# Altium project DCAC.PrjPcb (part 6 of 11)
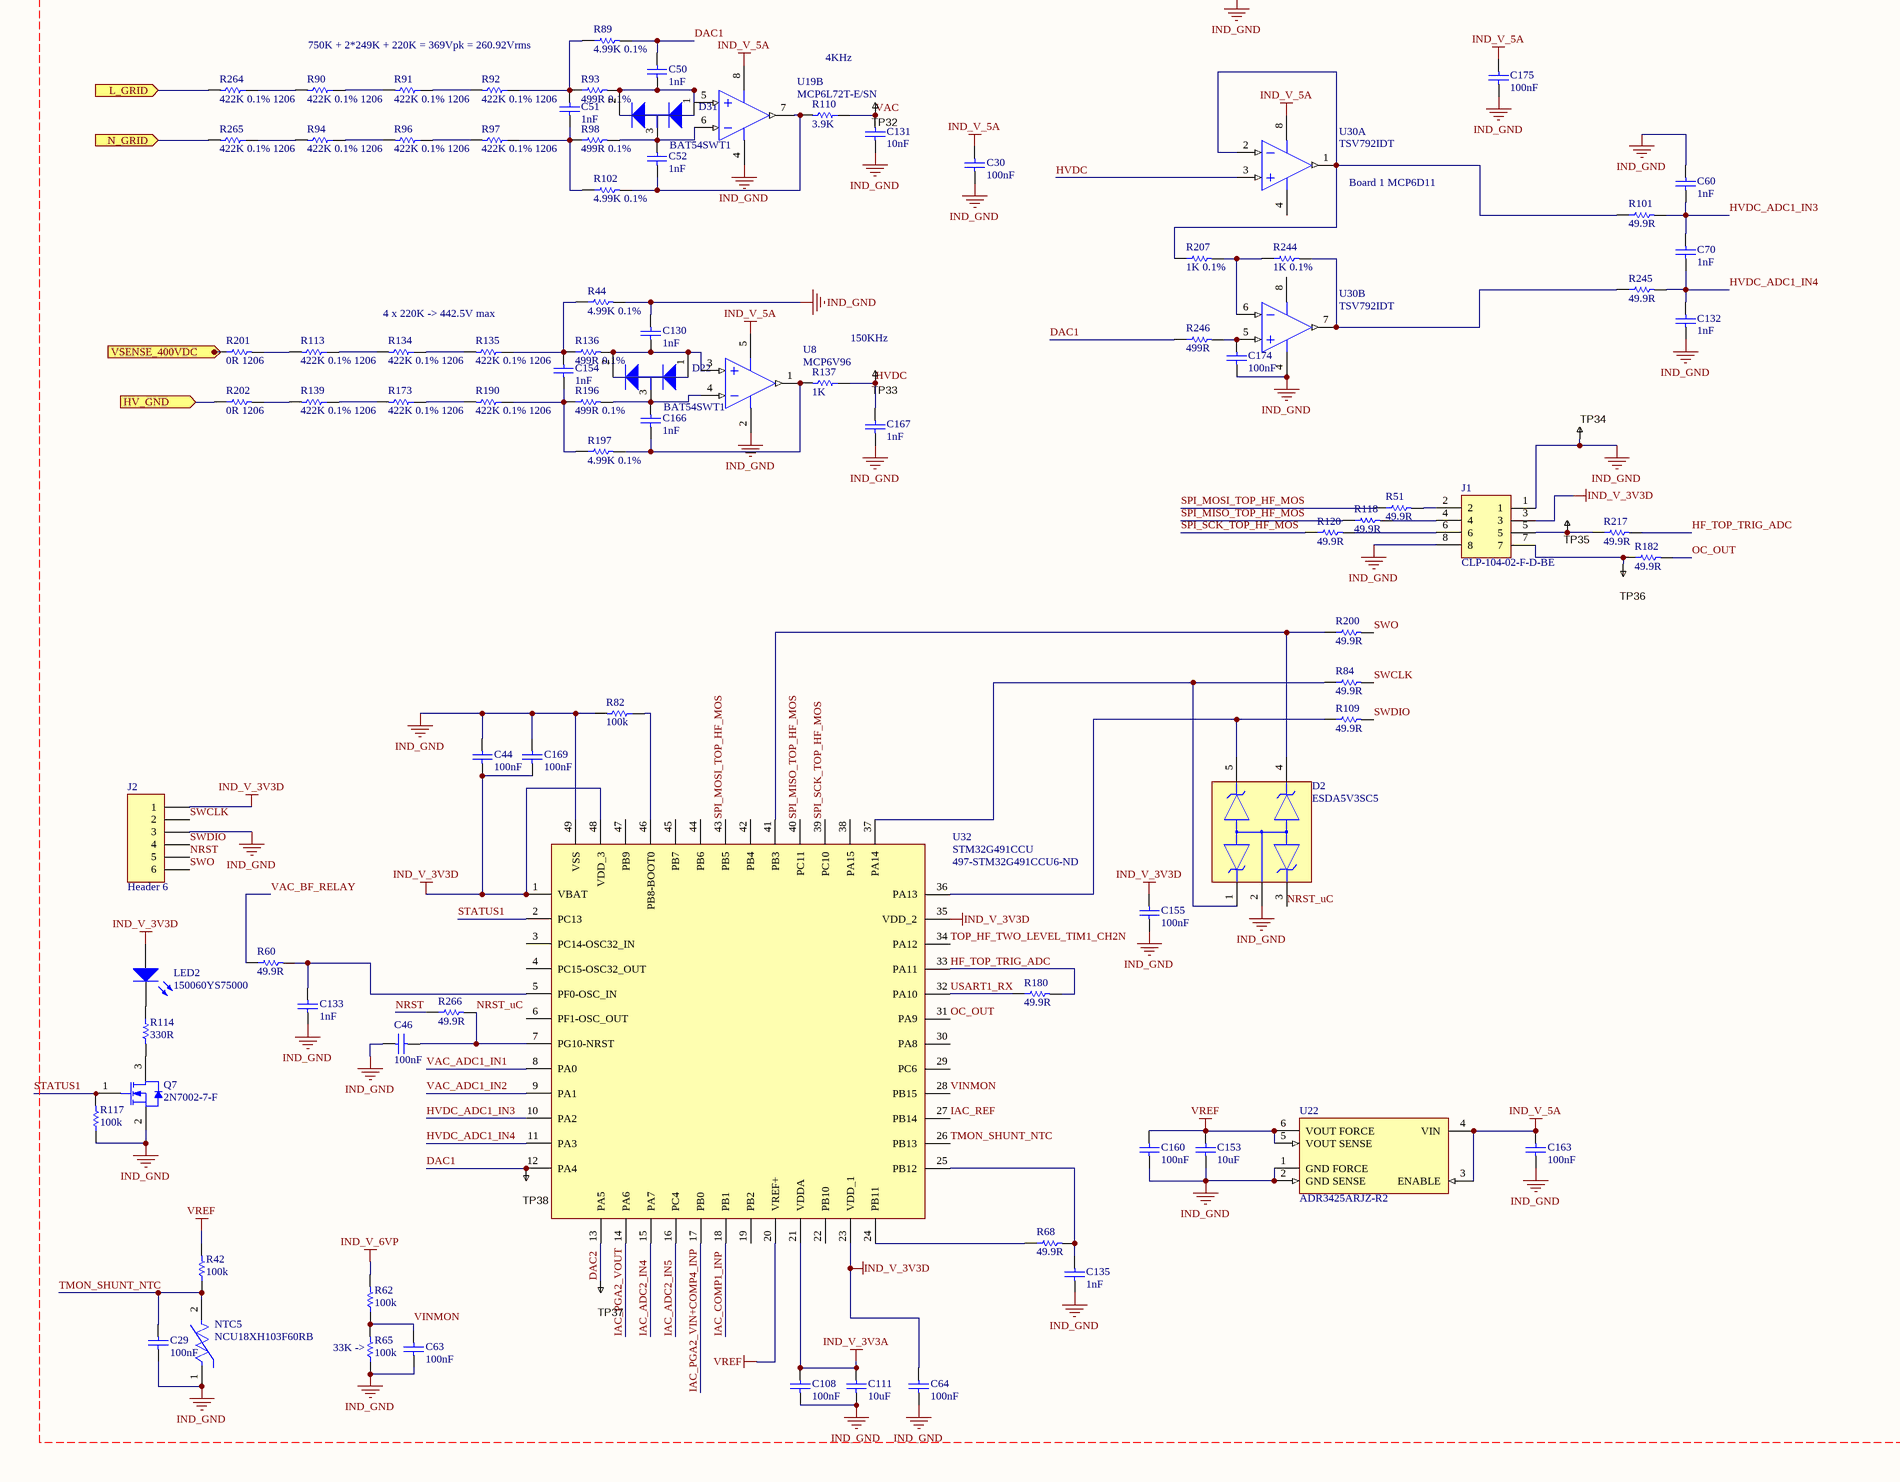
[diagram p16: IND_CURRENT_SENSE.SchDoc, bottom]

## Sheet IND_CURRENT_SENSE.SchDoc (continued)
### Library data of the parts
BR2 = CD-HD2006L: Bridge Rectifier; Manufacturer_Name: Bourns; Datasheet Link: https://componentsearchengine.com/Datasheets/1/CD-HD2006L.pdf; Height: 1.22mm; Manufacturer_Part_Number: CD-HD2006L; Mouser Part Number: 652-CD-HD2006L; Mouser Price/Stock: https://www.mouser.co.uk/ProductDetail/Bourns/CD-HD2006L?qs=zwwtnr6GuIxiiAFbFRVfeg%3D%3D; Arrow Part Number: CD-HD2006L; Arrow Price/Stock: https://www.arrow.com/en/products/cd-hd2006l/bourns
C7 C162 = CAP: X5R ±10% 10V 22uF 1206 Multilayer Ceramic Capacitors MLCC - SMD/SMT ROHS; Manufacturer: Kyocera AVX; Manufacturer Part Number: 12066C226KAT2A; Tolerance: Â±10%; Case-EIA: 1206; Rated Voltage: 6.3 V; Case-Metric: 3216; Voltage Rating: 6.3V; Dielectric: X7R; Dissipation Factor: 5%; Technology: SMT; Max Thickness: 1.9 mm; Value: 22uF; Supplier 1: Digi-Key; Supplier Part Number 1: 478-5997-1-ND; RoHS: Yes; Category: Ceramic Capacitors; Stock 1: 4915; Pricing 1: 1=0.81000, 10=0.57100, 100=0.37570, 500=0.27830, 1000=0.23656 (USD); Mount: Surface Mount; Case/Package: 1206; Number of Pins: 2; Case Code (Imperial): 1206; Case Code (Metric): 3216; Contact Plating: Tin,Matte; Min Operating Temperature: -55°C; Max Operating Temperature: 125°C; Capacitance: 22uF; Packaging: Tape and Reel; Package Quantity: 2500; Termination: SMD/SMT; Voltage Rating (DC): 6.3V; Voltage: 6.3V; Length: 3.2mm; Height: 1.78mm; Width: 1.6mm; Depth: 1.6mm; Thickness: 0.07inch; Radiation Hardening: No; REACH SVHC: No SVHC; Lead Free: Lead Free; ComponentLink1URL: https://datasheet.ciiva.com/11786/0900766b80dc2409-11786266.pdf?src-supplier=RSComponents; ComponentLink1Description: https://datasheet.ciiva.com/11786/0900766b80dc2409-11786266.pdf?src-supplier=RSComponents; ComponentLink2URL: https://datasheet.ciiva.com/16315/cx7r-16315655.pdf?src-supplier=Future+Electronics; ComponentLink2Description: https://datasheet.ciiva.com/16315/cx7r-16315655.pdf?src-supplier=Future+Electronics; ComponentLink3URL: https://datasheet.ciiva.com/154/cx7r-154924.pdf?src-supplier=Digi-Key; ComponentLink3Description: https://datasheet.ciiva.com/154/cx7r-154924.pdf?src-supplier=Digi-Key; ComponentLink4URL: https://datasheet.ciiva.com/154/cx7r-154925.pdf?src-supplier=Digi-Key; ComponentLink4Description: https://datasheet.ciiva.com/154/cx7r-154925.pdf?src-supplier=Digi-Key; ComponentLink5URL: https://datasheet.ciiva.com/154/cx7r-154926.pdf?src-supplier=Digi-Key; ComponentLink5Description: https://datasheet.ciiva.com/154/cx7r-154926.pdf?src-supplier=Digi-Key; Parameter 1: *; JLCPCB Part #: C5672
C11 C12 C156 = CAP-NP-2: X5R ±10% 50V 1uF 0603 Multilayer Ceramic Capacitors MLCC - SMD/SMT ROHS; Manufacturer: AVX; Rated Voltage: 10V; Capacitance: 1µF; Datasheet Version: 10/2007; Mounting Technology: SurfaceMount; Datasheet URL: https://datasheet.ciiva.com/11787/0900766b80a45521-11787469.pdf; Tolerance (%): ±10%; Package Description: 2-Pin Surface Mount Device, Body 1.6 x 0.81 mm; Case Size/Dimension: 0603; Package Reference: 0603; Manufacturer URL: http://www.avx.com/; Dielectric: X5R; Parameter 1: *; JLCPCB Part #: C15849
C18 = CAP-NP-2: X7R ±10% 50V 4.7uF 1206 Multilayer Ceramic Capacitors MLCC - SMD/SMT ROHS; Manufacturer: Kemet; Temperature Coefficient / Code: +/-15%; Voltage Rating DC: 25V; Capacitance - nF: 1000nF; Class: Class1; Case Length: 3.2mm; Type: SMDMLCCX7R6.3-250VDCCommericalGrade; Case Width: 1.6mm; Product: GeneralTypeMLCCs; Dielectric: X7R; Datasheet URL: https://ciiva.com/datasheet-click-18194173?src=ciiva&sig=6daff8c4; Operating Temperature Range: -55Cto+125C; Series: C1206C; RoHS: Details; Product Category: MultilayerCeramicCapacitorsMLCC-SMD/SMT; Manufacturer URL: http://www.kemet.com/; Minimum Operating Temperature: -55C; Dimensions: 1.6mmWx3.2mmLx1.6mmH; Termination Style: SMD/SMT; Brand: Kemet; Packaging: Reel; Package / Case: 1206(3216metric); Case Code - mm: 3216; Datasheet Version: Jul-14; Factory Pack Quantity: 2000; Package Description: 2-Pin Surface Mount Device, Body 3.2 x 1.6 mm; Tolerance: 10%; Package Reference: 1206; Case Height: 1.6mm; Case Code - in: 1206; Maximum Operating Temperature: +125C; Voltage Rating: 25V; Parameter 1: *; JLCPCB Part #: C29823
C19 C21 C30 C31 C44 C65 C73 C79 C96 C128 C139 C148 C152 C155 C158 C163 C169 C174 C175 = CAP: X7R 100nF ±10% 50V 0603 Multilayer Ceramic Capacitors MLCC - SMD/SMT ROHS; Part Number: GCM188R72A104KA64D; Manufacturer: Murata; Manufacturer Part Number: CC0603KRX7R9BB104; Voltage Rating: 100V; Supplier 1: Arrow Electronics; Supplier Part Number 1: GCM188R72A104KA64D; RoHS: Yes; Category: Ceramic Capacitors; Mount: Surface Mount; Case/Package: 0603; Case Code (Imperial): 0603; Case Code (Metric): 1608; Min Operating Temperature: -55°C; Max Operating Temperature: 125°C; Tolerance: 10%; Packaging: Tape and Reel; Capacitance: 100nF; Dielectric: X7R; Termination: SMD/SMT; Voltage Rating (DC): 100V; Length: 1.6mm; Height: 0.8mm; Depth: 0.8mm; Radiation Hardening: No; ComponentLink1URL: https://datasheet.ciiva.com/17451/product-17451047.pdf?src-supplier=Avnet+Europe; ComponentLink1Description: https://datasheet.ciiva.com/17451/product-17451047.pdf?src-supplier=Avnet+Europe; ComponentLink2URL: https://datasheet.ciiva.com/26889/getdatasheetpartid-387765-26889164.pdf?src-supplier=Verical; ComponentLink2Description: https://datasheet.ciiva.com/26889/getdatasheetpartid-387765-26889164.pdf?src-supplier=Verical; Parameter 1: *; JLCPCB Part #: C14663
C20 = CAP: X7R 1nF ±10% 50V 0402 Multilayer Ceramic Capacitors MLCC - SMD/SMT ROHS; Manufacturer: AVX Interconnect / Elco; Part Number: 04025C102MAT2A; Tolerance: 20%; Supplier 1: Digi-Key; Supplier Part Number 1: 478-5130-1-ND; Manufacturer Part Number: 04025C102MAT2A; RoHS: Yes; Category: Ceramic Capacitors; Stock 1: 32316; Pricing 1: 1=0.10000, 10=0.03300, 50=0.01800, 100=0.01470, 500=0.01046, 1000=0.00822, 2500=0.00748, 5000=0.00688 (USD); Mount: Surface Mount; Case/Package: 0402; Case Code (Metric): 1005; Case Code (Imperial): 0402; Min Operating Temperature: -55°C; Max Operating Temperature: 125°C; Capacitance: 1nF; Voltage Rating: 50V; Packaging: Tape and Reel; Package Quantity: 1; Voltage Rating (DC): 50V; Dielectric: X7R; Voltage: 50V; Series: -; Termination: SMD/SMT; Construction: Flat; Length: 1mm; Width: 0.02inch; Height: 0.56mm; Thickness: 0.022inch; Depth: 0.5mm; Radiation Hardening: No; RoHS Compliant: Yes; Lead Free: Lead Free; REACH SVHC: No SVHC; ComponentLink1URL: https://datasheet.ciiva.com/11787/0900766b80dc2409-11787048.pdf?src-supplier=RSComponents; ComponentLink1Description: https://datasheet.ciiva.com/11787/0900766b80dc2409-11787048.pdf?src-supplier=RSComponents; ComponentLink2URL: https://datasheet.ciiva.com/150/cx7r-150278.pdf?src-supplier=Digi-Key; ComponentLink2Description: https://datasheet.ciiva.com/150/cx7r-150278.pdf?src-supplier=Digi-Key; ComponentLink3URL: https://datasheet.ciiva.com/5424/cx7r-218113-5424822.pdf?src-supplier=Mouser; ComponentLink3Description: https://datasheet.ciiva.com/5424/cx7r-218113-5424822.pdf?src-supplier=Mouser; ComponentLink4URL: https://datasheet.ciiva.com/150/cx7r-150279.pdf?src-supplier=Digi-Key; ComponentLink4Description: https://datasheet.ciiva.com/150/cx7r-150279.pdf?src-supplier=Digi-Key; ComponentLink5URL: https://datasheet.ciiva.com/150/cx7r-150280.pdf?src-supplier=Digi-Key; ComponentLink5Description: https://datasheet.ciiva.com/150/cx7r-150280.pdf?src-supplier=Digi-Key; ComponentLink6URL: https://datasheet.ciiva.com/16327/cx7r-16327672.pdf?src-supplier=Future+Electronics; ComponentLink6Description: https://datasheet.ciiva.com/16327/cx7r-16327672.pdf?src-supplier=Future+Electronics; ComponentLink7URL: https://datasheet.ciiva.com/1123/1679506-1123707.pdf?src-supplier=Element14; ComponentLink7Description: https://datasheet.ciiva.com/1123/1679506-1123707.pdf?src-supplier=Element14; ComponentLink8URL: https://datasheet.ciiva.com/1123/1679506-1123708.pdf?src-supplier=Element14; ComponentLink8Description: https://datasheet.ciiva.com/1123/1679506-1123708.pdf?src-supplier=Element14; ComponentLink9URL: https://datasheet.ciiva.com/11510/cx7r-11510958.pdf?src-supplier=Avnet; ComponentLink9Description: https://datasheet.ciiva.com/11510/cx7r-11510958.pdf?src-supplier=Avnet; ComponentLink10URL: https://datasheet.ciiva.com/16623/cx7r-16623374.pdf?src-supplier=Avnet+Europe; ComponentLink10Description: https://datasheet.ciiva.com/16623/cx7r-16623374.pdf?src-supplier=Avnet+Europe; JLCPCB Part #: C1523
C22 C99 C131 C151 C190 = CMP-2006-02924-1: X7R ±10% 50V 10nF 0603 Multilayer Ceramic Capacitors MLCC - SMD/SMT ROHS; Part Number: GRM188R71H472KA01D; Manufacturer: Murata; Capacitance: 4.7nF; Insulation Resistance: 10GR; Supplier 1: Farnell; Supplier Part Number 1: 1118177; Manufacturer Part Number: GRM188R71H472KA01D; RoHS: Yes; Category: Ceramic Capacitors; Pricing 1: 1=19.92000, 3=19.13000 (GBP); Mount: Surface Mount; Case/Package: 0603; Number of Pins: 2; Case Code (Imperial): 0603; Case Code (Metric): 1608; Dielectric Material: Ceramic; Material: Ceramic; Min Operating Temperature: -55°C; Max Operating Temperature: 125°C; Voltage Rating (DC): 50V; Tolerance: 10%; Packaging: Tape and Reel; Dielectric: X7R; Series: GRM; Voltage Rating: 50V; Package Quantity: 1; Termination: SMD/SMT; Voltage: 50V; Length: 1.6mm; Width: 0.8mm; Height: 0.8mm; Depth: 0.8mm; Thickness: 0.035inch; Radiation Hardening: No; RoHS Compliant: Yes; REACH SVHC: No SVHC; Lead Free: Lead Free; ComponentLink1URL: https://datasheet.ciiva.com/5412/product-5412608.pdf?src-supplier=Mouser; ComponentLink1Description: https://datasheet.ciiva.com/5412/product-5412608.pdf?src-supplier=Mouser; ComponentLink2URL: https://datasheet.ciiva.com/18102/getdatasheetpartid-75298-18102657.pdf?src-supplier=Verical; ComponentLink2Description: https://datasheet.ciiva.com/18102/getdatasheetpartid-75298-18102657.pdf?src-supplier=Verical; ComponentLink3URL: https://datasheet.ciiva.com/11787/0900766b8003061f-11787116.pdf?src-supplier=RSComponents; ComponentLink3Description: https://datasheet.ciiva.com/11787/0900766b8003061f-11787116.pdf?src-supplier=RSComponents; ComponentLink4URL: https://datasheet.ciiva.com/29201/451888-da-01-en-vs-kondensator-0603-29201828.pdf?src-supplier=Conrad; ComponentLink4Description: https://datasheet.ciiva.com/29201/451888-da-01-en-vs-kondensator-0603-29201828.pdf?src-supplier=Conrad; ComponentLink5URL: https://datasheet.ciiva.com/7937/4360-7937669.pdf?src-supplier=Element14; ComponentLink5Description: https://datasheet.ciiva.com/7937/4360-7937669.pdf?src-supplier=Element14; ComponentLink6URL: https://datasheet.ciiva.com/48428/nmgrm-data-en-48428597.pdf?src-supplier=Distrelec; ComponentLink6Description: https://datasheet.ciiva.com/48428/nmgrm-data-en-48428597.pdf?src-supplier=Distrelec; ComponentLink7URL: https://datasheet.ciiva.com/7937/4360-7937670.pdf?src-supplier=Element14; ComponentLink7Description: https://datasheet.ciiva.com/7937/4360-7937670.pdf?src-supplier=Element14; ComponentLink8URL: https://datasheet.ciiva.com/7937/4360-7937671.pdf?src-supplier=Element14; ComponentLink8Description: https://datasheet.ciiva.com/7937/4360-7937671.pdf?src-supplier=Element14; ComponentLink9URL: https://datasheet.ciiva.com/130/partnumbering-e-01-130733.pdf?src-supplier=Digi-Key; ComponentLink9Description: https://datasheet.ciiva.com/130/partnumbering-e-01-130733.pdf?src-supplier=Digi-Key; ComponentLink10URL: https://datasheet.ciiva.com/130/partnumbering-e-01-130734.pdf?src-supplier=Digi-Key; ComponentLink10Description: https://datasheet.ciiva.com/130/partnumbering-e-01-130734.pdf?src-supplier=Digi-Key; ComponentLink11URL: https://datasheet.ciiva.com/130/partnumbering-e-01-130735.pdf?src-supplier=Digi-Key; ComponentLink11Description: https://datasheet.ciiva.com/130/partnumbering-e-01-130735.pdf?src-supplier=Digi-Key; JLCPCB Part #: C57112
C29 C46 C63 C64 C108 C160 = CAP: X7R 100nF ±10% 16V 0402 Multilayer Ceramic Capacitors MLCC - SMD/SMT ROHS; Manufacturer: AVX Interconnect / Elco; Part Number: 04026D104KAT2A; Voltage Rating: 6.3V; Dielectric: X5R; Supplier 1: Newark; Supplier Part Number 1: 34M9214; Manufacturer Part Number: 04026D104KAT2A; RoHS: Yes; Category: Ceramic Capacitors; Stock 1: 1436; Pricing 1: 10=0.02800, 25=0.02300, 50=0.01800, 100=0.01200, 250=0.01100, 500=0.00900, 1000=0.00700 (USD); Mount: Surface Mount; Case/Package: 0402; Case Code (Metric): 1005; Case Code (Imperial): 0402; Contact Plating: Tin,Matte; Dielectric Material: Ceramic; Min Operating Temperature: -55°C; Max Operating Temperature: 85°C; Package Quantity: 1; Packaging: Tape and Reel; Capacitance: 100nF; Tolerance: 10%; Voltage Rating (DC): 6.3V; Voltage: 6.3V; Termination: SMD/SMT; Series: -; Construction: Flat; Length: 1mm; Width: 0.02inch; Height: 0.56mm; Thickness: 0.022inch; Depth: 0.5mm; Radiation Hardening: No; REACH SVHC: No SVHC; Lead Free: Lead Free; RoHS Compliant: Yes; Parameter 1: *; JLCPCB Part #: C1525
C32 C39 C50-C52 C130 C145-C147 C154 C166 = CMP-2006-04245-1: X7R 1nF ±10% 50V 0603 Multilayer Ceramic Capacitors MLCC - SMD/SMT ROHS; Manufacturer: AVX Interconnect / Elco; Part Number: 06035A151JAT2A.; Manufacturer Part Number: 06035A151JAT2A; Capacitance: 100pF; Tolerance: 5%; Dielectric: C0G; Temperature Coefficient: 30ppm/°C; Insulation Resistance: 100GR; Supplier 1: Digi-Key; Supplier Part Number 1: 478-1177-1-ND; RoHS: Yes; Category: Ceramic Capacitors; Stock 1: 63714; Pricing 1: 1=0.12000, 10=0.08900, 100=0.04180, 500=0.02932, 1000=0.02428 (USD); Mount: Surface Mount,PCB; Case/Package: 0603; Number of Pins: 2; Case Code (Metric): 1608; Case Code (Imperial): 0603; Dielectric Material: Ceramic; Contact Plating: Tin,Matte; Min Operating Temperature: -55°C; Max Operating Temperature: 125°C; Voltage Rating (DC): 50V; Voltage Rating: 50V; Packaging: Tape and Reel; Package Quantity: 1; Termination: SMD/SMT; Voltage: 50V; Length: 1.6mm; Height: 0.86mm; Width: 0.032inch; Depth: 0.81mm; Thickness: 0.035inch; Radiation Hardening: No; Lead Free: Lead Free; REACH SVHC: No SVHC; ComponentLink1URL: https://datasheet.ciiva.com/1124/84496-1124721.pdf?src-supplier=Element14; ComponentLink1Description: https://datasheet.ciiva.com/1124/84496-1124721.pdf?src-supplier=Element14; ComponentLink2URL: https://datasheet.ciiva.com/2987/ccog-2987781.pdf?src-supplier=Avnet; ComponentLink2Description: https://datasheet.ciiva.com/2987/ccog-2987781.pdf?src-supplier=Avnet; ComponentLink3URL: https://datasheet.ciiva.com/7855/759117-7855061.pdf?src-supplier=Element14; ComponentLink3Description: https://datasheet.ciiva.com/7855/759117-7855061.pdf?src-supplier=Element14; ComponentLink4URL: https://datasheet.ciiva.com/2987/ccog-2987782.pdf?src-supplier=Avnet; ComponentLink4Description: https://datasheet.ciiva.com/2987/ccog-2987782.pdf?src-supplier=Avnet; ComponentLink5URL: https://datasheet.ciiva.com/156/ccog-156216.pdf?src-supplier=Digi-Key; ComponentLink5Description: https://datasheet.ciiva.com/156/ccog-156216.pdf?src-supplier=Digi-Key; ComponentLink6URL: https://datasheet.ciiva.com/156/ccog-156217.pdf?src-supplier=Digi-Key; ComponentLink6Description: https://datasheet.ciiva.com/156/ccog-156217.pdf?src-supplier=Digi-Key; ComponentLink7URL: https://datasheet.ciiva.com/156/ccog-156218.pdf?src-supplier=Digi-Key; ComponentLink7Description: https://datasheet.ciiva.com/156/ccog-156218.pdf?src-supplier=Digi-Key; ComponentLink8URL: https://datasheet.ciiva.com/16300/ccog-16300429.pdf?src-supplier=Future+Electronics; ComponentLink8Description: https://datasheet.ciiva.com/16300/ccog-16300429.pdf?src-supplier=Future+Electronics; ComponentLink9URL: https://datasheet.ciiva.com/22699/84496-22699966.pdf?src-supplier=Element14; ComponentLink9Description: https://datasheet.ciiva.com/22699/84496-22699966.pdf?src-supplier=Element14; ComponentLink10URL: https://datasheet.ciiva.com/5418/ccog-5418335.pdf?src-supplier=Mouser; ComponentLink10Description: https://datasheet.ciiva.com/5418/ccog-5418335.pdf?src-supplier=Mouser; ComponentLink11URL: https://datasheet.ciiva.com/16538/ccog-16538111.pdf?src-supplier=Avnet+Asia; ComponentLink11Description: https://datasheet.ciiva.com/16538/ccog-16538111.pdf?src-supplier=Avnet+Asia; Parameter 2: *; JLCPCB Part #: C1588
C34 C40 C41 C60 C70 C83 C84 C132 C133 C135 C164 C165 = CMP-2008-02701-1: X7R 1nF ±10% 50V 0402 Multilayer Ceramic Capacitors MLCC - SMD/SMT ROHS; Manufacturer: AVX Interconnect / Elco; Part Number: 04025C102MAT2A; Tolerance: 20%; Supplier 1: Digi-Key; Supplier Part Number 1: 478-5130-1-ND; Manufacturer Part Number: 04025C102MAT2A; RoHS: Yes; Category: Ceramic Capacitors; Stock 1: 32316; Pricing 1: 1=0.10000, 10=0.03300, 50=0.01800, 100=0.01470, 500=0.01046, 1000=0.00822, 2500=0.00748, 5000=0.00688 (USD); Mount: Surface Mount; Case/Package: 0402; Case Code (Metric): 1005; Case Code (Imperial): 0402; Min Operating Temperature: -55°C; Max Operating Temperature: 125°C; Capacitance: 1nF; Voltage Rating: 50V; Packaging: Tape and Reel; Package Quantity: 1; Voltage Rating (DC): 50V; Dielectric: X7R; Voltage: 50V; Series: -; Termination: SMD/SMT; Construction: Flat; Length: 1mm; Width: 0.02inch; Height: 0.56mm; Thickness: 0.022inch; Depth: 0.5mm; Radiation Hardening: No; RoHS Compliant: Yes; Lead Free: Lead Free; REACH SVHC: No SVHC; ComponentLink1URL: https://datasheet.ciiva.com/11787/0900766b80dc2409-11787048.pdf?src-supplier=RSComponents; ComponentLink1Description: https://datasheet.ciiva.com/11787/0900766b80dc2409-11787048.pdf?src-supplier=RSComponents; ComponentLink2URL: https://datasheet.ciiva.com/150/cx7r-150278.pdf?src-supplier=Digi-Key; ComponentLink2Description: https://datasheet.ciiva.com/150/cx7r-150278.pdf?src-supplier=Digi-Key; ComponentLink3URL: https://datasheet.ciiva.com/5424/cx7r-218113-5424822.pdf?src-supplier=Mouser; ComponentLink3Description: https://datasheet.ciiva.com/5424/cx7r-218113-5424822.pdf?src-supplier=Mouser; ComponentLink4URL: https://datasheet.ciiva.com/150/cx7r-150279.pdf?src-supplier=Digi-Key; ComponentLink4Description: https://datasheet.ciiva.com/150/cx7r-150279.pdf?src-supplier=Digi-Key; ComponentLink5URL: https://datasheet.ciiva.com/150/cx7r-150280.pdf?src-supplier=Digi-Key; ComponentLink5Description: https://datasheet.ciiva.com/150/cx7r-150280.pdf?src-supplier=Digi-Key; ComponentLink6URL: https://datasheet.ciiva.com/16327/cx7r-16327672.pdf?src-supplier=Future+Electronics; ComponentLink6Description: https://datasheet.ciiva.com/16327/cx7r-16327672.pdf?src-supplier=Future+Electronics; ComponentLink7URL: https://datasheet.ciiva.com/1123/1679506-1123707.pdf?src-supplier=Element14; ComponentLink7Description: https://datasheet.ciiva.com/1123/1679506-1123707.pdf?src-supplier=Element14; ComponentLink8URL: https://datasheet.ciiva.com/1123/1679506-1123708.pdf?src-supplier=Element14; ComponentLink8Description: https://datasheet.ciiva.com/1123/1679506-1123708.pdf?src-supplier=Element14; ComponentLink9URL: https://datasheet.ciiva.com/11510/cx7r-11510958.pdf?src-supplier=Avnet; ComponentLink9Description: https://datasheet.ciiva.com/11510/cx7r-11510958.pdf?src-supplier=Avnet; ComponentLink10URL: https://datasheet.ciiva.com/16623/cx7r-16623374.pdf?src-supplier=Avnet+Europe; ComponentLink10Description: https://datasheet.ciiva.com/16623/cx7r-16623374.pdf?src-supplier=Avnet+Europe; JLCPCB Part #: C1523
C36 C167 = CAP: X7R 1nF ±10% 50V 0603 Multilayer Ceramic Capacitors MLCC - SMD/SMT ROHS; Manufacturer: AVX Interconnect / Elco; Part Number: 06035A151JAT2A.; Manufacturer Part Number: 06035A151JAT2A; Capacitance: 100pF; Tolerance: 5%; Dielectric: C0G; Temperature Coefficient: 30ppm/°C; Insulation Resistance: 100GR; Supplier 1: Digi-Key; Supplier Part Number 1: 478-1177-1-ND; RoHS: Yes; Category: Ceramic Capacitors; Stock 1: 63714; Pricing 1: 1=0.12000, 10=0.08900, 100=0.04180, 500=0.02932, 1000=0.02428 (USD); Mount: Surface Mount,PCB; Case/Package: 0603; Number of Pins: 2; Case Code (Metric): 1608; Case Code (Imperial): 0603; Dielectric Material: Ceramic; Contact Plating: Tin,Matte; Min Operating Temperature: -55°C; Max Operating Temperature: 125°C; Voltage Rating (DC): 50V; Voltage Rating: 50V; Packaging: Tape and Reel; Package Quantity: 1; Termination: SMD/SMT; Voltage: 50V; Length: 1.6mm; Height: 0.86mm; Width: 0.032inch; Depth: 0.81mm; Thickness: 0.035inch; Radiation Hardening: No; Lead Free: Lead Free; REACH SVHC: No SVHC; ComponentLink1URL: https://datasheet.ciiva.com/1124/84496-1124721.pdf?src-supplier=Element14; ComponentLink1Description: https://datasheet.ciiva.com/1124/84496-1124721.pdf?src-supplier=Element14; ComponentLink2URL: https://datasheet.ciiva.com/2987/ccog-2987781.pdf?src-supplier=Avnet; ComponentLink2Description: https://datasheet.ciiva.com/2987/ccog-2987781.pdf?src-supplier=Avnet; ComponentLink3URL: https://datasheet.ciiva.com/7855/759117-7855061.pdf?src-supplier=Element14; ComponentLink3Description: https://datasheet.ciiva.com/7855/759117-7855061.pdf?src-supplier=Element14; ComponentLink4URL: https://datasheet.ciiva.com/2987/ccog-2987782.pdf?src-supplier=Avnet; ComponentLink4Description: https://datasheet.ciiva.com/2987/ccog-2987782.pdf?src-supplier=Avnet; ComponentLink5URL: https://datasheet.ciiva.com/156/ccog-156216.pdf?src-supplier=Digi-Key; ComponentLink5Description: https://datasheet.ciiva.com/156/ccog-156216.pdf?src-supplier=Digi-Key; ComponentLink6URL: https://datasheet.ciiva.com/156/ccog-156217.pdf?src-supplier=Digi-Key; ComponentLink6Description: https://datasheet.ciiva.com/156/ccog-156217.pdf?src-supplier=Digi-Key; ComponentLink7URL: https://datasheet.ciiva.com/156/ccog-156218.pdf?src-supplier=Digi-Key; ComponentLink7Description: https://datasheet.ciiva.com/156/ccog-156218.pdf?src-supplier=Digi-Key; ComponentLink8URL: https://datasheet.ciiva.com/16300/ccog-16300429.pdf?src-supplier=Future+Electronics; ComponentLink8Description: https://datasheet.ciiva.com/16300/ccog-16300429.pdf?src-supplier=Future+Electronics; ComponentLink9URL: https://datasheet.ciiva.com/22699/84496-22699966.pdf?src-supplier=Element14; ComponentLink9Description: https://datasheet.ciiva.com/22699/84496-22699966.pdf?src-supplier=Element14; ComponentLink10URL: https://datasheet.ciiva.com/5418/ccog-5418335.pdf?src-supplier=Mouser; ComponentLink10Description: https://datasheet.ciiva.com/5418/ccog-5418335.pdf?src-supplier=Mouser; ComponentLink11URL: https://datasheet.ciiva.com/16538/ccog-16538111.pdf?src-supplier=Avnet+Asia; ComponentLink11Description: https://datasheet.ciiva.com/16538/ccog-16538111.pdf?src-supplier=Avnet+Asia; Parameter 2: *; JLCPCB Part #: C1588
C94 C111 C153 C157 = CAP-NP-2: X5R ±10% 10V 10uF 0603 Multilayer Ceramic Capacitors MLCC - SMD/SMT ROHS; Manufacturer: Samsung Electro-Mechanics; Manufacturer Part Number: CL10B104KB8NNNC; Capacitance: 0.1µF; Rated Voltage: 50V; Dielectric: X7R; Case Size/Dimension: 0603; Datasheet URL: https://datasheet.ciiva.com/29198/456651-da-01-en-vs-kondensator-0605-29198839.pdf; Manufacturer URL: http://www.samsungsem.com/global/index.jsp; Tolerance (%): ±10%; Datasheet Version: Nov-10; Supplier 1: Digi-Key; Supplier Part Number 1: 1276-1000-1-ND; RoHS: Yes; Category: Ceramic Capacitors; Stock 1: 13409690; Pricing 1: 1=0.10000, 10=0.03000, 50=0.01620, 100=0.01330, 500=0.00950, 1000=0.00746 (USD); Mount: Surface Mount; Case/Package: 0603; Case Code (Metric): 1608; Case Code (Imperial): 0603; Contact Plating: Tin; Material: Ceramic; Min Operating Temperature: -55°C; Max Operating Temperature: 125°C; Voltage Rating: 50V; Package Quantity: 1; Packaging: Tape and Reel; Tolerance: 10%; Voltage Rating (DC): 50V; Voltage: 50V; Series: CL; Construction: Flat; Length: 1.6mm; Width: 0.031inch; Height: 0.8mm; Depth: 0.8mm; Thickness: 0.035inch; Radiation Hardening: No; Lead Free: Lead Free; RoHS Compliant: Yes; ComponentLink1URL: https://datasheet.ciiva.com/25803/cl10b104kb8nnnc-25803393.pdf?src-supplier=Digi-Key; ComponentLink1Description: https://datasheet.ciiva.com/25803/cl10b104kb8nnnc-25803393.pdf?src-supplier=Digi-Key; ComponentLink2URL: https://datasheet.ciiva.com/26838/getdatasheetpartid-89097-26838411.pdf?src-supplier=Verical; ComponentLink2Description: https://datasheet.ciiva.com/26838/getdatasheetpartid-89097-26838411.pdf?src-supplier=Verical; ComponentLink3URL: https://datasheet.ciiva.com/29198/456651-da-01-en-vs-kondensator-0605-29198839.pdf?src-supplier=Conrad; ComponentLink3Description: https://datasheet.ciiva.com/29198/456651-da-01-en-vs-kondensator-0605-29198839.pdf?src-supplier=Conrad; Parameter 1: *; JLCPCB Part #: C19702
C101 C143 = CAP: X5R 25V ±10% 10uF 0805 Multilayer Ceramic Capacitors MLCC - SMD/SMT ROHS; Part Number: GRM21BR71A106KE51L; Manufacturer: Murata; Parameter 1: *; JLCPCB Part #: C15850
D2 = ba4253d81ba893034e2a76e8f43080a: TVS DIODE 3V SOT323-5; Manufacturer Part Number: ESDA6V1W5; Manufacturer: STMicroelectronics; Value: 90pF; Max Junction Temp: +125°C; Breakdown Voltage: 6.1V; Standoff Height: 0mm; Number Of Channels: 2; Peak Pulse Power: 150W; Direction: Unidirectional; Temperature Range Low: -40°C; Temperature Range High: +125°C; Octopart: https://octopart.com/esda6v1w5-stmicroelectronics-39557953; Device Class L1: Circuit Protection; Digikey Description: TVS DIODE 3V SOT323-5; Mouser Description: TVS Diodes / ESD Suppressors 6.1V 150W Unidirect; Capacitance: 90pF; Device Class L2: TVS Diodes; Reverse Standoff Voltage: 3V; Category: Diode; Ipc Land Pattern Name: SOT65P210X95-5; Lead Free: Yes; ComponentLink2Description: Datasheet; Height: 1.1mm; Temperature: -40°C to +125°C; Package: SOT323-5L; Device Class L3: unset; RoHS: TRUE; ComponentLink2URL: https://www.st.com/resource/en/datasheet/esdaxxxwx.pdf; Automotive: No; Parameter 1: *; JLCPCB Part #: *
D9 D22 D31 D32 = CMP-1055-00560-1: Dual Series Schottky Barrier Diodes, 3-Pin SOT-323, Tape and Reel; Manufacturer: On Semiconductor; IFSM Max (A): 0.6; trr Max (ns): 5; ComponentLink3Description: Package Specification; RoHS: FALSE; ComponentLink1URL: http://www.onsemi.com/; PartNumber: BAT54SWT1; ComponentLink1Description: Manufacturer URL; Packing: Tape and Reel; PackageReference: SOT-323-3-419-04; ComponentLink2URL: http://www.onsemi.cn/pub_link/Collateral/BAT54SWT1-D.PDF; ComponentLink2Description: Datasheet; PackageDescription: 3-Pin Small Outline Transistor, Body 2 x 1.25 mm, Pitch 0.65 mm; Configuration: Dual; ComponentLink3URL: http://www.onsemi.com/pub_link/Collateral/419-04.PDF; Mounting Technology: Surface Mount; PackageVersion: Rev. N, 11/2008; DatasheetVersion: Rev. 10
FB1 FB13 FB19 = CMP-0220-00115-1: SMD EMI Suppression Ferrite Bead WE-CBF, Z = 1500 Ohm; DatasheetVersion: Dec-2005; ComponentLink1URL: http://www.we-online.com; PackageVersion: 2009; PackageDescription: Chip Inductor, 2-Leads, Body 1.6 x 0.8 mm; ComponentLink2URL: http://www.we-online.de/katalog/media/pdf/742792691.pdf; ComponentLink1Description: Manufacturer Link; ComponentLink2Description: Datasheet; Impedance: 1500 Ohm; PackageReference: SMD-0603
J1 = CLP-104-02-F-D-BE: Connector; Manufacturer_Name: SAMTEC; Datasheet Link: http://suddendocs.samtec.com/prints/erm8-xxx-xx.x-xxx-dv-xxxx-xx-mkt.pdf; Manufacturer_Part_Number: CLP-104-02-F-D-BE; Mouser Part Number: 200-CLP10402FDBE; Mouser Price/Stock: https://www.mouser.co.uk/ProductDetail/Samtec/CLP-104-02-F-D-BE?qs=0lQeLiL1qybJIh6Z%2F3PMbA%3D%3D; Arrow Part Number: CLP-104-02-F-D-BE; Arrow Price/Stock: https://www.arrow.com/en/products/clp-104-02-f-d-be/samtec
J2 = Header 6: Header, 6-Pin; LatestRevisionDate: 17-Jul-2002; LatestRevisionNote: Re-released for DXP Platform.; Publisher: Altium Limited
L5 = CMP-08253-000028-1: INDUCTORS FOR POWER CIRCUITS, AU
LED2 = CMP-1426-00005-1: SMD mono-color Chip LED, WL-SMCW, Yellow; Manufacturer: Wuerth Elektronik; Dominant Wavelength: 590nm; Viewing Angle: 140°; Lens Style: Clear,Rectangular; Luminous Intensity: 120mcd; Forward Voltage: 2V; Forward Current: 30mA; Test Current: 20mA; ComponentLink1URL: http://www.we-online.com; PartNumber: 150060YS75000; Color: Yellow; ComponentLink2Description: Datasheet; ComponentLink2URL: http://katalog.we-online.com/led/datasheet/150060YS75000.pdf; ComponentLink1Description: Manufacturer URL; PackageReference: 0603_A; Supplier 1: Digi-Key; Supplier Part Number 1: 732-4981-1-ND; Manufacturer Part Number: 150060YS75000; RoHS: Yes; Category: LEDs; Stock 1: 139; Pricing 1: 1=0.14000, 50=0.13300, 100=0.11400, 500=0.09900 (USD); Mount: Surface Mount; Case/Package: 0603; Case Code (Imperial): 0603; Case Code (Metric): 1608; Min Operating Temperature: -40°C; Max Operating Temperature: 85°C; Packaging: Tape and Reel; Package Quantity: 4000; Wavelength: 590nm; Length: 1.6mm; Height: 0.7mm; Width: 0.8mm; REACH SVHC: Unknown; ComponentLink3URL: https://datasheet.ciiva.com/23843/150060ys75000-23843250.pdf?src-supplier=Newark; ComponentLink3Description: https://datasheet.ciiva.com/23843/150060ys75000-23843250.pdf?src-supplier=Newark; ComponentLink4URL: https://datasheet.ciiva.com/29279/759432-da-01-en-chipled-0603-w-kl-gelb-150060ys75000-29279206.pdf?src-supplier=Conrad; ComponentLink4Description: https://datasheet.ciiva.com/29279/759432-da-01-en-chipled-0603-w-kl-gelb-150060ys75000-29279206.pdf?src-supplier=Conrad; ComponentLink5URL: https://datasheet.ciiva.com/29563/150060ys75000-29563045.pdf?src-supplier=Digi-Key; ComponentLink5Description: https://datasheet.ciiva.com/29563/150060ys75000-29563045.pdf?src-supplier=Digi-Key; ComponentLink6URL: https://datasheet.ciiva.com/22656/1911348-22656951.pdf?src-supplier=Element14; ComponentLink6Description: https://datasheet.ciiva.com/22656/1911348-22656951.pdf?src-supplier=Element14; ComponentLink7URL: https://datasheet.ciiva.com/29563/150060ys75000-29563033.pdf?src-supplier=Digi-Key; ComponentLink7Description: https://datasheet.ciiva.com/29563/150060ys75000-29563033.pdf?src-supplier=Digi-Key; ComponentLink8URL: https://datasheet.ciiva.com/48430/150060ys75000-eng-tds-48430044.pdf?src-supplier=Distrelec; ComponentLink8Description: https://datasheet.ciiva.com/48430/150060ys75000-eng-tds-48430044.pdf?src-supplier=Distrelec
NTC5 = CMP-06022-000443-2: THERMISTOR NTC; Max Operating Temperature: 125°C; REACH SVHC: No SVHC; Case/Package: 0603; Min Operating Temperature: -40°C; RoHS Compliant: Yes; Case Code (Imperial): 0603; Case Code (Metric): 1608
PT_SEC2 = CMP-1024-00320-1: 0.025" SQ Post Header, Through-hole, Right Angle, -55 to 125 degC, 2.54 mm Pitch, 2-Pin, Male, RoHS; Manufacturer: Samtec; Pitch: 2.54 mm; Temperature Range: -55 to 125 degC; PackageDescription: .025[0.64] SQ. Post Terminal Strip Assembly; ComponentLink3Description: Package Specification; ComponentLink2Description: Datasheet; PackageReference: TSW-102-08-X-S-RA; ComponentLink1Description: Manufacturer URL; ComponentLink2URL: http://www.samtec.com/documents/webfiles/pdf/TSW_TH.PDF; PackageVersion: DM, 8/1988; RoHS: True; PartNumber: TSW-102-08-G-S-RA; Mounting Technology: Through-hole; Orientation: Right Angle; ComponentLink1URL: http://www.samtec.com; DatasheetVersion: F-214; ComponentLink3URL: http://www.samtec.com/documents/webfiles/cpdf/TSW-XXX-XX-XXX-X-XX-XXX-MKT.pdf
Q7 = NEMOS-GSD-3: N-Channel Enhancement Mode Field Effect Transistor, 60 V, 0.115 A, -55 to 150 degC, 3-Pin SOT23, RoHS, Tape and Reel; Id - Continuous Drain Current: 115mA; Typical Turn-On Delay Time: 7ns; Typical Turn-Off Delay Time: 11ns; Brand: DiodesIncorporated; Transistor Type: 1N-Channel; Vgs - Gate-Source Voltage: 20V; Rise Time: 3ns; Configuration: Single; Fall Time: 5.6ns; Vds - Drain-Source Breakdown Voltage: 70V; Rds On - Drain-Source Resistance: 7.5Ohms; Number of Channels: 1Channel; Forward Transconductance - Min: 0.08S; Pd - Power Dissipation: 300mW; Unit Weight: 0.000282oz; Datasheet URL: http://datasheet.octopart.com/2N7002-7-F-Diodes-Inc.-datasheet-8326113.pdf; Width: 1.3mm; Series: 2N7002; Length: 2.9mm; Product Category: MOSFET; Minimum Operating Temperature: -55C; Manufacturer URL: http://www.diodes.com/; Mounting Style: SMD/SMT; Package Reference: SOT23-3; Package Description: 3-Pin Small Outline Transistor, Body 2.9 x 1.3 mm, Pitch 0.96 mm; Maximum Operating Temperature: +150C; Transistor Polarity: N-Channel; Factory Pack Quantity: 3000; Technology: Si; Channel Mode: Enhancement; Datasheet Version: Rev. 21-2, 02/2009; Type: EnhancementModeFieldEffectTransistor; RoHS: True; Packaging: Reel; Package / Case: SOT-23-3; Height: 1mm; Product: MOSFETSmallSignal; Manufacturer: DiodesIncorporated; Parameter 1: *; JLCPCB Part #: C8545
R1 = CMP-2100-03667-1: ±1% 0Ω 0.1W 0603 Chip Resistor - Surface Mount ROHS; Manufacturer: Yageo; Manufacturer Part Number: RC0603JR-070RL; Temperature Coefficient: 200ppm/degreesC; Tolerance: 5%; Voltage Rating: 50V; Power Rating: 100mW; Resistance: 0mOhm; Width: 0.8mm; Max Operating Temperature: 155degC; Package Reference: 0603; Height: 0.45mm; Depth: 0.8mm; Package Description: 2-Pin Surface Mount Device, Body 1.6 x 0.8 mm; Termination: SMD/SMT; Package Quantity: 5000; Case/Package: 0603; Case Code (Imperial): 0603; Radiation Hardening: No; Number of Pins: 2; Length: 1.6mm; Lead Free: LeadFree; Voltage Rating (DC): 50V; Military Standard: Not; Datasheet URL: http://www.yageo.com/NewPortal/yageodocoutput?fileName=/pdf/R-Chip/PYu-RC_Group_51_RoHS_L_5.pdf; Manufacturer URL: http://www.yageo.com/; Packaging: TapeandReel; Case Code (Metric): 1608; Min Operating Temperature: -55degC; Composition: ThickFilm; RoHSCompliant: true; Contact Plating: Tin; Datasheet Version: Rev. 5, 10/2016; REACH SVHC: NoSVHC; Supplier 1: Digi-Key; Supplier Part Number 1: 311-0.0GRCT-ND; RoHS: Yes; Category: Chip SMD Resistors; Stock 1: 4763183; Pricing 1: 1=0.10000, 10=0.01700, 25=0.01240, 50=0.00940, 100=0.00700, 250=0.00532, 500=0.00424, 1000=0.00313 (USD); Size Code: 0603; Resistor Type: Thick Film; Max Power Dissipation: 100mW; Number of Terminations: 2; Series: RC; Construction: Rectangular; Features: Moisture Resistant; Technology: THICK FILM; Resistance Tolerance: 5%; RoHS Compliant: Yes; ComponentLink1URL: https://datasheet.ciiva.com/11808/pyu-r-int-6-11808700.pdf?src-supplier=RSComponents; ComponentLink1Description: https://datasheet.ciiva.com/11808/pyu-r-int-6-11808700.pdf?src-supplier=RSComponents; ComponentLink2URL: https://datasheet.ciiva.com/22747/443971-22747530.pdf?src-supplier=Element14; ComponentLink2Description: https://datasheet.ciiva.com/22747/443971-22747530.pdf?src-supplier=Element14; ComponentLink3URL: https://datasheet.ciiva.com/12555/rc0603-272842-12555254.pdf?src-supplier=Mouser; ComponentLink3Description: https://datasheet.ciiva.com/12555/rc0603-272842-12555254.pdf?src-supplier=Mouser; ComponentLink4URL: https://datasheet.ciiva.com/7746/1738695-7746421.pdf?src-supplier=Element14; ComponentLink4Description: https://datasheet.ciiva.com/7746/1738695-7746421.pdf?src-supplier=Element14; ComponentLink5URL: https://datasheet.ciiva.com/7746/1738695-7746422.pdf?src-supplier=Element14; ComponentLink5Description: https://datasheet.ciiva.com/7746/1738695-7746422.pdf?src-supplier=Element14; ComponentLink6URL: https://datasheet.ciiva.com/8883/pyu-rc0603-51-rohs-l-4-8883045.pdf?src-supplier=Avnet; ComponentLink6Description: https://datasheet.ciiva.com/8883/pyu-rc0603-51-rohs-l-4-8883045.pdf?src-supplier=Avnet; ComponentLink7URL: https://datasheet.ciiva.com/15189/getdatasheetpartid-329462-15189845.pdf?src-supplier=Verical; ComponentLink7Description: https://datasheet.ciiva.com/15189/getdatasheetpartid-329462-15189845.pdf?src-supplier=Verical; JLCPCB Part #: C21189
R6 = RES: 18kΩ ±1% ±100ppm/℃ 0.1W 0603 Chip Resistor - Surface Mount ROHS; Manufacturer: Panasonic; Part Number: ERA3AEB183V; Manufacturer Part Number: ERA-3AEB183V; Resistance: 18kR; Power Rating: 100mW; Tolerance: 0.1%; Temperature Coefficient: 25ppm/°C; Voltage Rating (DC): 75V; Supplier 1: Newark; Supplier Part Number 1: 08N2107; RoHS: Yes; Category: Chip SMD Resistors; Stock 1: 2207; Pricing 1: 1=0.35700, 25=0.30700, 50=0.21600, 100=0.12400, 250=0.10000, 500=0.07500, 1000=0.05100 (USD); Mount: Surface Mount; Case/Package: 0603; Number of Pins: 2; Case Code (Metric): 1608; Case Code (Imperial): 0603; Contact Plating: Tin; Size Code: 0603; Min Operating Temperature: -55°C; Max Operating Temperature: 155°C; Packaging: Tape and Reel; Resistor Type: Thin Film; Number of Terminations: 2; Max Power Dissipation: 100mW; Series: ERA-3A; Voltage Rating: 75V; Package Quantity: 1; Termination: SMD/SMT; Features: Automotive AEC-Q200; Resistance Tolerance: 0.1%; Construction: Rectangular; Technology: METAL FILM; Length: 1.6mm; Width: 0.8mm; Height: 0.45mm; Depth: 0.8mm; Radiation Hardening: No; RoHS Compliant: Yes; Lead Free: Lead Free; REACH SVHC: No SVHC; Military Standard: Not; ComponentLink1URL: https://datasheet.ciiva.com/11808/0900766b80fe20f7-11808020.pdf?src-supplier=RSComponents; ComponentLink1Description: https://datasheet.ciiva.com/11808/0900766b80fe20f7-11808020.pdf?src-supplier=RSComponents; ComponentLink2URL: https://datasheet.ciiva.com/29183/451333-da-01-en-widerstand-0603-era-29183823.pdf?src-supplier=Conrad; ComponentLink2Description: https://datasheet.ciiva.com/29183/451333-da-01-en-widerstand-0603-era-29183823.pdf?src-supplier=Conrad; ComponentLink3URL: https://datasheet.ciiva.com/16395/aoa0000ce26-16395253.pdf?src-supplier=Future+Electronics; ComponentLink3Description: https://datasheet.ciiva.com/16395/aoa0000ce26-16395253.pdf?src-supplier=Future+Electronics; ComponentLink4URL: https://datasheet.ciiva.com/16764/70068849-16764837.pdf?src-supplier=Allied+Electronics; ComponentLink4Description: https://datasheet.ciiva.com/16764/70068849-16764837.pdf?src-supplier=Allied+Electronics; ComponentLink5URL: https://datasheet.ciiva.com/9117/aoa0000ce26-9117398.pdf?src-supplier=Avnet; ComponentLink5Description: https://datasheet.ciiva.com/9117/aoa0000ce26-9117398.pdf?src-supplier=Avnet; ComponentLink6URL: https://datasheet.ciiva.com/17211/aoa0000ce26-17211238.pdf?src-supplier=Avnet+Europe; ComponentLink6Description: https://datasheet.ciiva.com/17211/aoa0000ce26-17211238.pdf?src-supplier=Avnet+Europe; ComponentLink7URL: https://datasheet.ciiva.com/22739/485442-22739288.pdf?src-supplier=Element14; ComponentLink7Description: https://datasheet.ciiva.com/22739/485442-22739288.pdf?src-supplier=Element14; ComponentLink8URL: https://datasheet.ciiva.com/48425/era-eng-tds-48425433.pdf?src-supplier=Distrelec; ComponentLink8Description: https://datasheet.ciiva.com/48425/era-eng-tds-48425433.pdf?src-supplier=Distrelec; ComponentLink9URL: https://datasheet.ciiva.com/48530/era-eng-tds-48530218.pdf?src-supplier=Distrelec; ComponentLink9Description: https://datasheet.ciiva.com/48530/era-eng-tds-48530218.pdf?src-supplier=Distrelec; ComponentLink10URL: https://datasheet.ciiva.com/5860/485442-5860507.pdf?src-supplier=Farnell; ComponentLink10Description: https://datasheet.ciiva.com/5860/485442-5860507.pdf?src-supplier=Farnell; ComponentLink11URL: https://datasheet.ciiva.com/16771/70068849-16771099.pdf?src-supplier=Allied+Electronics; ComponentLink11Description: https://datasheet.ciiva.com/16771/70068849-16771099.pdf?src-supplier=Allied+Electronics; ComponentLink12URL: https://datasheet.ciiva.com/5860/485442-5860508.pdf?src-supplier=Farnell; ComponentLink12Description: https://datasheet.ciiva.com/5860/485442-5860508.pdf?src-supplier=Farnell; ComponentLink13URL: https://datasheet.ciiva.com/7944/485442-7944492.pdf?src-supplier=Element14; ComponentLink13Description: https://datasheet.ciiva.com/7944/485442-7944492.pdf?src-supplier=Element14; ComponentLink14URL: https://datasheet.ciiva.com/30234/54aoa0000ce26-30234638.pdf?src-supplier=Onlinecomponents.com; ComponentLink14Description: https://datasheet.ciiva.com/30234/54aoa0000ce26-30234638.pdf?src-supplier=Onlinecomponents.com; ComponentLink15URL: https://datasheet.ciiva.com/46422/485442-46422590.pdf?src-supplier=Element14; ComponentLink15Description: https://datasheet.ciiva.com/46422/485442-46422590.pdf?src-supplier=Element14; ComponentLink16URL: https://datasheet.ciiva.com/46422/485442-46422591.pdf?src-supplier=Element14; ComponentLink16Description: https://datasheet.ciiva.com/46422/485442-46422591.pdf?src-supplier=Element14; Parameter 1: *; JLCPCB Part #: C25810
R7 = RES-2: Chip Resistor, 0 Ohm, +/- 5%, 0.1 W, -55 to 155 degC, 0603 (1608 Metric), RoHS, Tape and Reel; Manufacturer: Yageo; Manufacturer Part Number: RC0603JR-070RL; Temperature Coefficient: 200ppm/degreesC; Voltage Rating: 50V; Power Rating: 100mW; Resistance: 0mOhm; Width: 0.8mm; Max Operating Temperature: 155degC; Tolerance: 5%; Package Reference: 0603; Height: 0.45mm; Depth: 0.8mm; Package Description: 2-Pin Surface Mount Device, Body 1.6 x 0.8 mm; Termination: SMD/SMT; Package Quantity: 5000; Case/Package: 0603; Case Code (Imperial): 0603; Radiation Hardening: No; Number of Pins: 2; Length: 1.6mm; Lead Free: LeadFree; Voltage Rating (DC): 50V; Military Standard: Not; Datasheet URL: http://www.yageo.com/NewPortal/yageodocoutput?fileName=/pdf/R-Chip/PYu-RC_Group_51_RoHS_L_5.pdf; Manufacturer URL: http://www.yageo.com/; Packaging: TapeandReel; Case Code (Metric): 1608; Min Operating Temperature: -55degC; Composition: ThickFilm; RoHSCompliant: true; Contact Plating: Tin; Datasheet Version: Rev. 5, 10/2016; REACH SVHC: NoSVHC; Supplier 1: Avnet; Supplier Part Number 1: RC0603JR-070RL; RoHS: Yes; Category: Chip SMD Resistors; Stock 1: 1330000; Pricing 1: 5000=0.00138, 10000=0.00136, 20000=0.00132, 30000=0.00129, 40000=0.00124, 50000=0.00121, 500000=0.00118 (USD); Size Code: 0603; Resistor Type: Thick Film; Series: RC; Max Power Dissipation: 100mW; Construction: Rectangular; Number of Terminations: 2; Features: Moisture Resistant; Technology: THICK FILM; Resistance Tolerance: 5%; RoHS Compliant: Yes; ComponentLink1URL: https://datasheet.ciiva.com/11808/pyu-r-int-6-11808700.pdf?src-supplier=RSComponents; ComponentLink1Description: https://datasheet.ciiva.com/11808/pyu-r-int-6-11808700.pdf?src-supplier=RSComponents; ComponentLink2URL: https://datasheet.ciiva.com/22747/443971-22747530.pdf?src-supplier=Element14; ComponentLink2Description: https://datasheet.ciiva.com/22747/443971-22747530.pdf?src-supplier=Element14; ComponentLink3URL: https://datasheet.ciiva.com/12555/rc0603-272842-12555254.pdf?src-supplier=Mouser; ComponentLink3Description: https://datasheet.ciiva.com/12555/rc0603-272842-12555254.pdf?src-supplier=Mouser; ComponentLink4URL: https://datasheet.ciiva.com/7746/1738695-7746421.pdf?src-supplier=Element14; ComponentLink4Description: https://datasheet.ciiva.com/7746/1738695-7746421.pdf?src-supplier=Element14; ComponentLink5URL: https://datasheet.ciiva.com/7746/1738695-7746422.pdf?src-supplier=Element14; ComponentLink5Description: https://datasheet.ciiva.com/7746/1738695-7746422.pdf?src-supplier=Element14; ComponentLink6URL: https://datasheet.ciiva.com/8883/pyu-rc0603-51-rohs-l-4-8883045.pdf?src-supplier=Avnet; ComponentLink6Description: https://datasheet.ciiva.com/8883/pyu-rc0603-51-rohs-l-4-8883045.pdf?src-supplier=Avnet; ComponentLink7URL: https://datasheet.ciiva.com/15189/getdatasheetpartid-329462-15189845.pdf?src-supplier=Verical; ComponentLink7Description: https://datasheet.ciiva.com/15189/getdatasheetpartid-329462-15189845.pdf?src-supplier=Verical
R8 R32 R51 R60 R61 R68 R72 R84 R101 R109 R118 R120 R180 R182 R200 R210 R217 R245 = CMP-2002-00969-1: 1/16W ±1% ±200ppm/℃ 49.9Ω 0402 Chip Resistor - Surface Mount ROHS; Manufacturer: Panasonic; Part Number: ERJ-2RKF49R9X; JLCPCB Part #: C25120
R9 R14 R53-R55 R57 R63 R73 R207 R244 R246 = CMP-2000-04525-1: RES SMD 1K OHM 0.1% 1/10W 0603; Part Number: RT0603BRE071KL; Manufacturer: Yageo; Resistance: 1kR; Power Rating: 100mW; Temperature Coefficient: 50ppm/°C; Voltage Rating (DC): 50V; Supplier 1: Digi-Key; Supplier Part Number 1: YAG2314CT-ND; Manufacturer Part Number: RT0603BRE071KL; RoHS: Yes; Category: Chip SMD Resistors; Stock 1: 173; Pricing 1: 1=0.38000, 10=0.27500, 100=0.11000, 1000=0.05420, 2500=0.05021 (USD); Case/Package: 0603; Case Code (Metric): 1608; Case Code (Imperial): 0603; Size Code: 0603; Min Operating Temperature: -55°C; Max Operating Temperature: 155°C; Packaging: Tape and Reel; Resistor Type: Thin Film; Tolerance: 0.1%; Number of Terminations: 2; Series: RT; Max Power Dissipation: 100mW; Construction: Rectangular; Package Quantity: 5000; Features: Moisture Resistant; Length: 0.063inch; Width: 0.031inch; Height: 0.022inch; Depth: 0.8mm; RoHS Compliant: Yes; Military Standard: Not; Lead Free: Lead Free; ComponentLink1URL: https://datasheet.ciiva.com/2584/pyu-rt-1-to-0-05-rohs-l-5-2584317.pdf?src-supplier=Digi-Key; ComponentLink1Description: https://datasheet.ciiva.com/2584/pyu-rt-1-to-0-05-rohs-l-5-2584317.pdf?src-supplier=Digi-Key
R11 R137 R256 = RES: ±1% ±100ppm/℃ 1kΩ 0.1W 0603 Chip Resistor - Surface Mount ROHS; Part Number: ERJ-3EKF1001V; Manufacturer: Panasonic; Manufacturer Part Number: ERJ3EKF1001V; Resistance: 1kR; Power Rating: 100mW; Voltage Rating: 75V; Temperature Coefficient: 100ppm/°C; Supplier 1: Future Electronics; Supplier Part Number 1: 3028514; RoHS: Yes; Category: Chip SMD Resistors; Stock 1: 430000; Pricing 1: 5000=0.01860, 10000=0.01510, 15000=0.01500, 20000=0.01490 (USD); Mount: Surface Mount; Case/Package: 0603; Number of Pins: 2; Case Code (Metric): 1608; Case Code (Imperial): 0603; Contact Plating: Tin; Size Code: 0603; Min Operating Temperature: -55°C; Max Operating Temperature: 155°C; Packaging: Tape and Reel; Tolerance: 1%; Termination: SMD/SMT; Package Quantity: 5000; Series: ERJ; Resistor Type: Thick Film; Max Power Dissipation: 100mW; Construction: Rectangular; Resistance Tolerance: 1%; Number of Terminations: 2; Features: Automotive AEC-Q200; Voltage Rating (DC): 75V; Technology: THICK FILM; Length: 1.6mm; Width: 0.8mm; Height: 0.45mm; Depth: 0.8mm; Radiation Hardening: No; REACH SVHC: No SVHC; Lead Free: Lead Free; RoHS Compliant: Yes; Military Standard: Not; ComponentLink1URL: https://datasheet.ciiva.com/16768/70260748-16768437.pdf?src-supplier=Allied+Electronics; ComponentLink1Description: https://datasheet.ciiva.com/16768/70260748-16768437.pdf?src-supplier=Allied+Electronics; ComponentLink2URL: https://datasheet.ciiva.com/16774/70260748-16774550.pdf?src-supplier=Allied+Electronics; ComponentLink2Description: https://datasheet.ciiva.com/16774/70260748-16774550.pdf?src-supplier=Allied+Electronics; ComponentLink3URL: https://datasheet.ciiva.com/16449/aoa0000ce2-16449065.pdf?src-supplier=Future+Electronics; ComponentLink3Description: https://datasheet.ciiva.com/16449/aoa0000ce2-16449065.pdf?src-supplier=Future+Electronics; ComponentLink4URL: https://datasheet.ciiva.com/7942/aoa0000ce2-7942427.pdf?src-supplier=Element14; ComponentLink4Description: https://datasheet.ciiva.com/7942/aoa0000ce2-7942427.pdf?src-supplier=Element14; ComponentLink5URL: https://datasheet.ciiva.com/9198/aoa0000ce2-9198923.pdf?src-supplier=Avnet; ComponentLink5Description: https://datasheet.ciiva.com/9198/aoa0000ce2-9198923.pdf?src-supplier=Avnet; ComponentLink6URL: https://datasheet.ciiva.com/46373/1678782-46373339.pdf?src-supplier=Element14; ComponentLink6Description: https://datasheet.ciiva.com/46373/1678782-46373339.pdf?src-supplier=Element14; ComponentLink7URL: https://datasheet.ciiva.com/48530/aoa0000ce2-48530987.pdf?src-supplier=Avnet; ComponentLink7Description: https://datasheet.ciiva.com/48530/aoa0000ce2-48530987.pdf?src-supplier=Avnet; ComponentLink8URL: https://datasheet.ciiva.com/46373/1678782-46373340.pdf?src-supplier=Element14; ComponentLink8Description: https://datasheet.ciiva.com/46373/1678782-46373340.pdf?src-supplier=Element14; ComponentLink9URL: https://datasheet.ciiva.com/24070/aoa0000ce2-24070269.pdf?src-supplier=Mouser; ComponentLink9Description: https://datasheet.ciiva.com/24070/aoa0000ce2-24070269.pdf?src-supplier=Mouser; ComponentLink10URL: https://datasheet.ciiva.com/22673/1678782-22673918.pdf?src-supplier=Element14; ComponentLink10Description: https://datasheet.ciiva.com/22673/1678782-22673918.pdf?src-supplier=Element14; ComponentLink11URL: https://datasheet.ciiva.com/30063/aoa0000ce2-30063390.pdf?src-supplier=Onlinecomponents.com; ComponentLink11Description: https://datasheet.ciiva.com/30063/aoa0000ce2-30063390.pdf?src-supplier=Onlinecomponents.com; ComponentLink12URL: https://datasheet.ciiva.com/17215/aoa0000ce2-17215311.pdf?src-supplier=Avnet+Europe; ComponentLink12Description: https://datasheet.ciiva.com/17215/aoa0000ce2-17215311.pdf?src-supplier=Avnet+Europe; Parameter 1: *; JLCPCB Part #: C21190